# EAGLE schematic wachcio_meteo_unlock (EAGLE 7.7.0)

## Sheet 1 of 3: urzadzenie
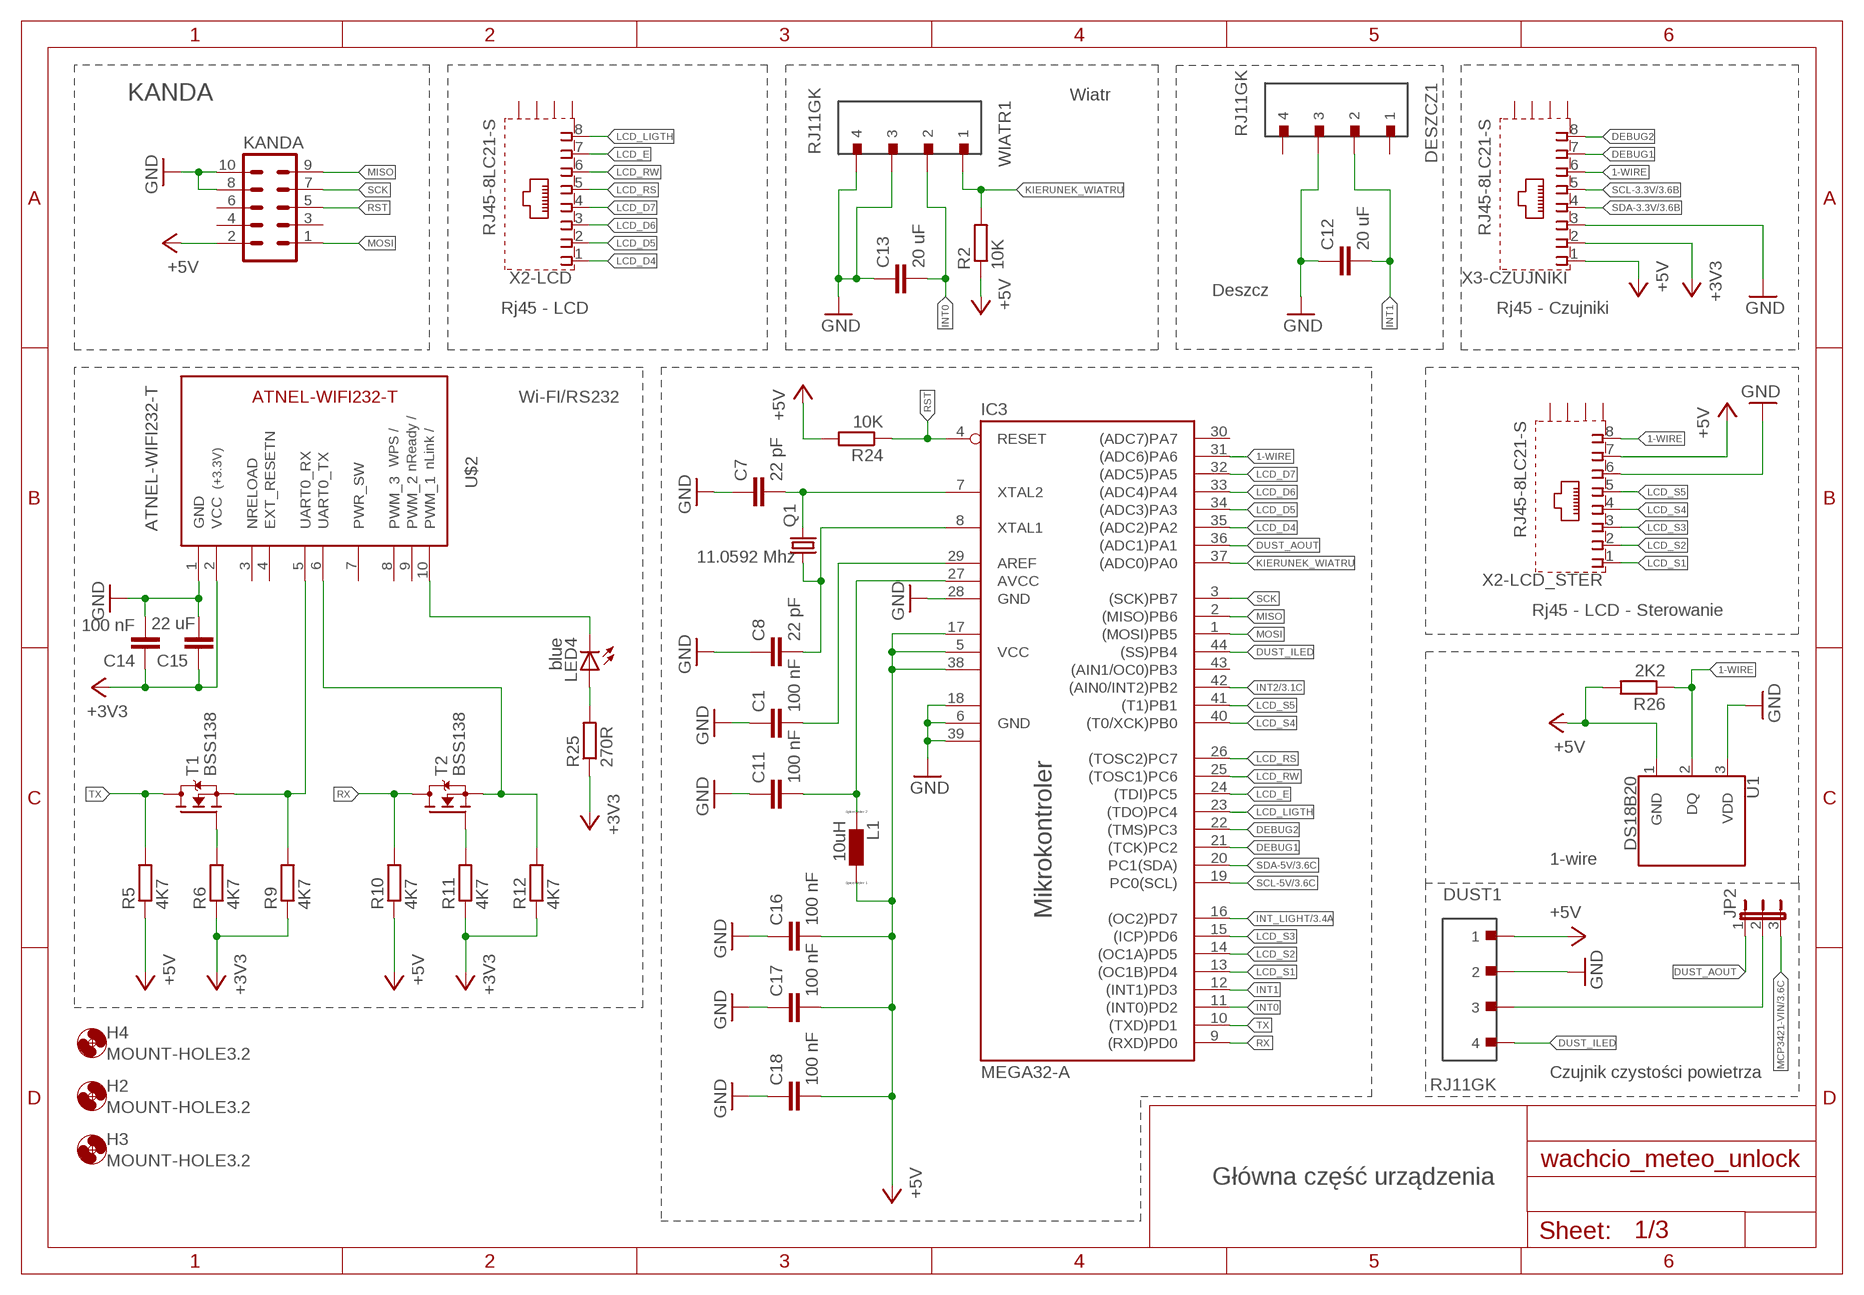
[diagram p0: schematic, sheet 1]

### Parts
C1  100 nF  C-EUC0805  [C0805]
C7  22 pF  C-EUC0805  [C0805]
C8  22 pF  C-EUC0805  [C0805]
C11  100 nF  C-EUC0805  [C0805]
C12  20 uF  C-EUC0805  [C0805]
C13  20 uF  C-EUC0805  [C0805]
C14  100 nF  C-EUC0805  [C0805]
C15  22 uF  C-EUC0805  [C0805]
C16  100 nF  C-EUC0805  [C0805]
C17  100 nF  C-EUC0805  [C0805]
C18  100 nF  C-EUC0805  [C0805]
DESZCZ1  RJ11GK  [RJ11GK]
DUST1  RJ11GK  [RJ11GK]
H2  MOUNT-HOLE3.2  [3,2]
H3  MOUNT-HOLE3.2  [3,2]
H4  MOUNT-HOLE3.2  [3,2]
IC3  MEGA32-A  [TQFP44]
JP2  JP2E  [JP2]
KANDA  ML10  [ML10]
L1  10uH  LL3230M  [L3230M]
LED4  blue  LEDCHIPLED_1206  [CHIPLED_1206]
Q1  11.0592 Mhz  CRYSTALSM49  [SM49]
R2  10K  R-EU_M0805  [M0805]
R5  4K7  R-EU_M0805  [M0805]
R6  4K7  R-EU_M0805  [M0805]
R9  4K7  R-EU_M0805  [M0805]
R10  4K7  R-EU_M0805  [M0805]
R11  4K7  R-EU_M0805  [M0805]
R12  4K7  R-EU_M0805  [M0805]
R24  10K  R-EU_M0805  [M0805]
R25  270R  R-EU_M0805  [M0805]
R26  2K2  R-EU_M0805  [M0805]
T1  BSS138  MOSFET-N-SOT23  [SOT23]
T2  BSS138  MOSFET-N-SOT23  [SOT23]
U1  DS18B20  [TO-92-AMMO]
U$2  ATNEL-WIFI232-T  [ATNEL-WIFI232-T]
WIATR1  RJ11GK  [RJ11GK]
X2-LCD  RJ45-8LC21-S  [RJ45-SHIELD1]
X2-LCD_STER  RJ45-8LC21-S  [RJ45-SHIELD1]
X3-CZUJNIKI  RJ45-8LC21-S  [RJ45-SHIELD1]

### Nets
1-WIRE: IC3.31((ADC6)PA6) R26.1 U1.2(DQ) X2-LCD_STER.8 X3-CZUJNIKI.6
+3V3: C14.1 C15.1 R6.1 R9.1 R11.1 R12.1 R25.1 U$2.2(VCC) X3-CZUJNIKI.2 ; also sheet 2,3
+5V: C16.2 C17.2 C18.2 DUST1.1 IC3.5(VCC) IC3.17(VCC1) IC3.38(VCC2) KANDA.2 L1.1 R2.1 R5.1 R10.1 R24.2 R26.2 U1.1(GND) X2-LCD_STER.7 X3-CZUJNIKI.1 ; also sheet 2,3
DEBUG1: IC3.21((TCK)PC2) X3-CZUJNIKI.7
DEBUG2: IC3.22((TMS)PC3) X3-CZUJNIKI.8
DUST_AOUT: IC3.36((ADC1)PA1) JP2.1
DUST_ILED: DUST1.4 IC3.44((SS)PB4)
GND: C1.1 C7.1 C8.1 C11.1 C12.1 C13.1 C14.2 C15.2 C16.1 C17.1 C18.1 DESZCZ1.3 DUST1.2 IC3.6(GND) IC3.18(GND1) IC3.28(GND) IC3.39(GND2) KANDA.8 KANDA.10 U1.3(VDD) U$2.1(GND) WIATR1.3 WIATR1.4 X2-LCD_STER.6 X3-CZUJNIKI.3 ; also sheet 2,3
INT0: C13.2 IC3.11((INT0)PD2) WIATR1.2
INT1: C12.2 DESZCZ1.2 IC3.12((INT1)PD3)
INT2: IC3.42((AIN0/INT2)PB2) ; also sheet 3
INT_LIGHT: IC3.16((OC2)PD7) ; also sheet 3
KIERUNEK_WIATRU: IC3.37((ADC0)PA0) R2.2 WIATR1.1
LCD_D4: IC3.35((ADC2)PA2) X2-LCD.1
LCD_D5: IC3.34((ADC3)PA3) X2-LCD.2
LCD_D6: IC3.33((ADC4)PA4) X2-LCD.3
LCD_D7: IC3.32((ADC5)PA5) X2-LCD.4
LCD_E: IC3.24((TDI)PC5) X2-LCD.7
LCD_LIGTH: IC3.23((TDO)PC4) X2-LCD.8
LCD_RS: IC3.26((TOSC2)PC7) X2-LCD.5
LCD_RW: IC3.25((TOSC1)PC6) X2-LCD.6
LCD_S1: IC3.13((OC1B)PD4) X2-LCD_STER.1
LCD_S2: IC3.14((OC1A)PD5) X2-LCD_STER.2
LCD_S3: IC3.15((ICP)PD6) X2-LCD_STER.3
LCD_S4: IC3.40((T0/XCK)PB0) X2-LCD_STER.4
LCD_S5: IC3.41((T1)PB1) X2-LCD_STER.5
MCP3421-VIN: JP2.3 ; also sheet 3
MISO: IC3.2((MISO)PB6) KANDA.9
MOSI: IC3.1((MOSI)PB5) KANDA.1
N$1: R9.2 T1.2(S) U$2.5(UART0_RX)
N$2: C11.2 IC3.27(AVCC) L1.2
N$3: C1.2 IC3.29(AREF)
N$5: LED4.A R25.2
N$6: R6.2 T1.1(G)
N$8: LED4.C U$2.10(PWM_1)
N$9: R12.2 T2.2(S) U$2.6(UART0_TX)
N$10: C7.2 IC3.7(XTAL2) Q1.2
N$11: C8.2 IC3.8(XTAL1) Q1.1
N$16: DUST1.3 JP2.2
N$22: R11.2 T2.1(G)
RST: IC3.4(RESET) KANDA.5 R24.1
RX: IC3.9((RXD)PD0) R10.2 T2.3(D)
SCK: IC3.3((SCK)PB7) KANDA.7
SCL-3.3V: X3-CZUJNIKI.5 ; also sheet 3
SCL-5V: IC3.19(PC0(SCL)) ; also sheet 3
SDA-3.3V: X3-CZUJNIKI.4 ; also sheet 3
SDA-5V: IC3.20(PC1(SDA)) ; also sheet 3
TX: IC3.10((TXD)PD1) R5.2 T1.3(D)
Unconnected: DESZCZ1.1 DESZCZ1.4 IC3.30((ADC7)PA7) IC3.43((AIN1/OC0)PB3) KANDA.3 KANDA.4 KANDA.6 U$2.3(NRELOAD) U$2.4(EXT_RESETN) U$2.7(PWR_SW) U$2.8(PWM_3) U$2.9(PWM_2) X2-LCD.S1(S) X2-LCD.S2(S) X2-LCD.S3(S) X2-LCD.S4(S) X2-LCD_STER.S1(S) X2-LCD_STER.S2(S) X2-LCD_STER.S3(S) X2-LCD_STER.S4(S) X3-CZUJNIKI.S1(S) X3-CZUJNIKI.S2(S) X3-CZUJNIKI.S3(S) X3-CZUJNIKI.S4(S)

### Notes on the sheet
- KANDA | Wiatr
- Deszcz
- Rj45 - LCD | Rj45 - Czujniki
- Wi-FI/RS232
- Rj45 - LCD - Sterowanie
- 1-wire
- Mikrokontroler
- Czujnik czystości powietrza
- Główna część urządzenia

## Sheet 2 of 3: zasilanie
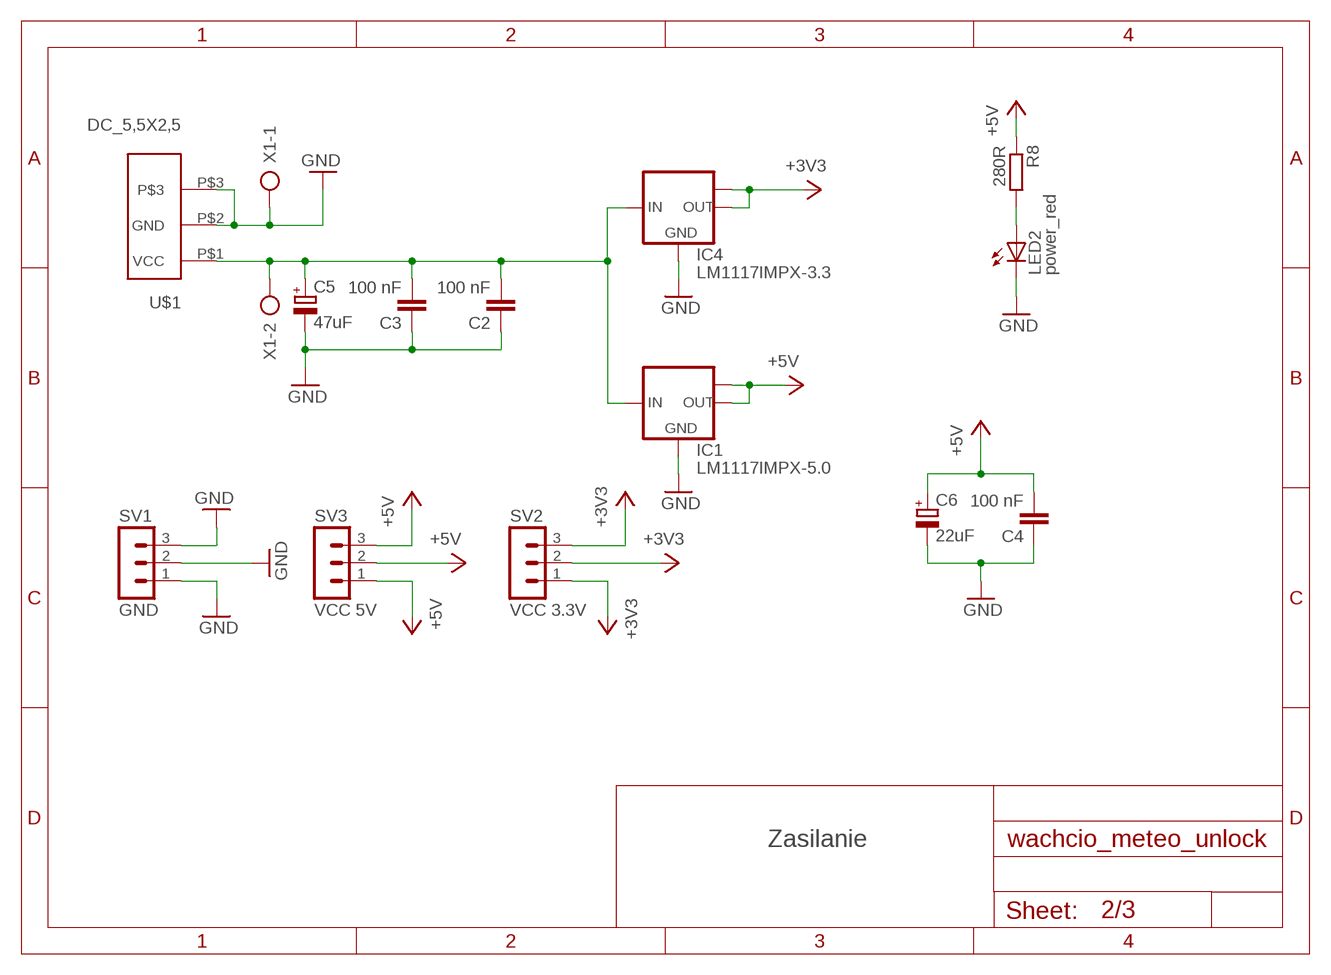
[diagram p1: schematic, sheet 2]

### Parts
C2  100 nF  C-EUC0805  [C0805]
C3  100 nF  C-EUC0805  [C0805]
C4  100 nF  C-EUC0805  [C0805]
C5  47uF  CPOL-EUB45181A  [B45181A]
C6  22uF  CPOL-EUB45181A  [B45181A]
IC1  LM1117IMPX-5.0  [SOT223]
IC4  LM1117IMPX-3.3  [SOT223]
LED2  power_red  LEDCHIPLED_1206  [CHIPLED_1206]
R8  280R  R-EU_M0805  [M0805]
SV1  GND  MA03-1  [MA03-1]
SV2  VCC 3.3V  MA03-1  [MA03-1]
SV3  VCC 5V  MA03-1  [MA03-1]
U$1  DC_5,5X2,5  [DC_5,5X2,5]
X1  AK500/2  [AK500/2]

### Nets
+3V3: IC4.2(OUT) IC4.TAB(OUT1) SV2.1 SV2.2 SV2.3 ; also sheet 1,3
+5V: C4.2 C6.+ IC1.2(OUT) IC1.TAB(OUT1) R8.1 SV3.1 SV3.2 SV3.3 ; also sheet 1,3
+9V: C2.2 C3.2 C5.+ IC1.3(IN) IC4.3(IN) U$1.P$1(VCC) X1.2
GND: C2.1 C3.1 C4.1 C5.- C6.- IC1.1(GND) IC4.1(GND) LED2.C SV1.1 SV1.2 SV1.3 U$1.P$2(GND) U$1.P$3 X1.1 ; also sheet 1,3
N$12: LED2.A R8.2

### Notes on the sheet
- Zasilanie

## Sheet 3 of 3: I2C
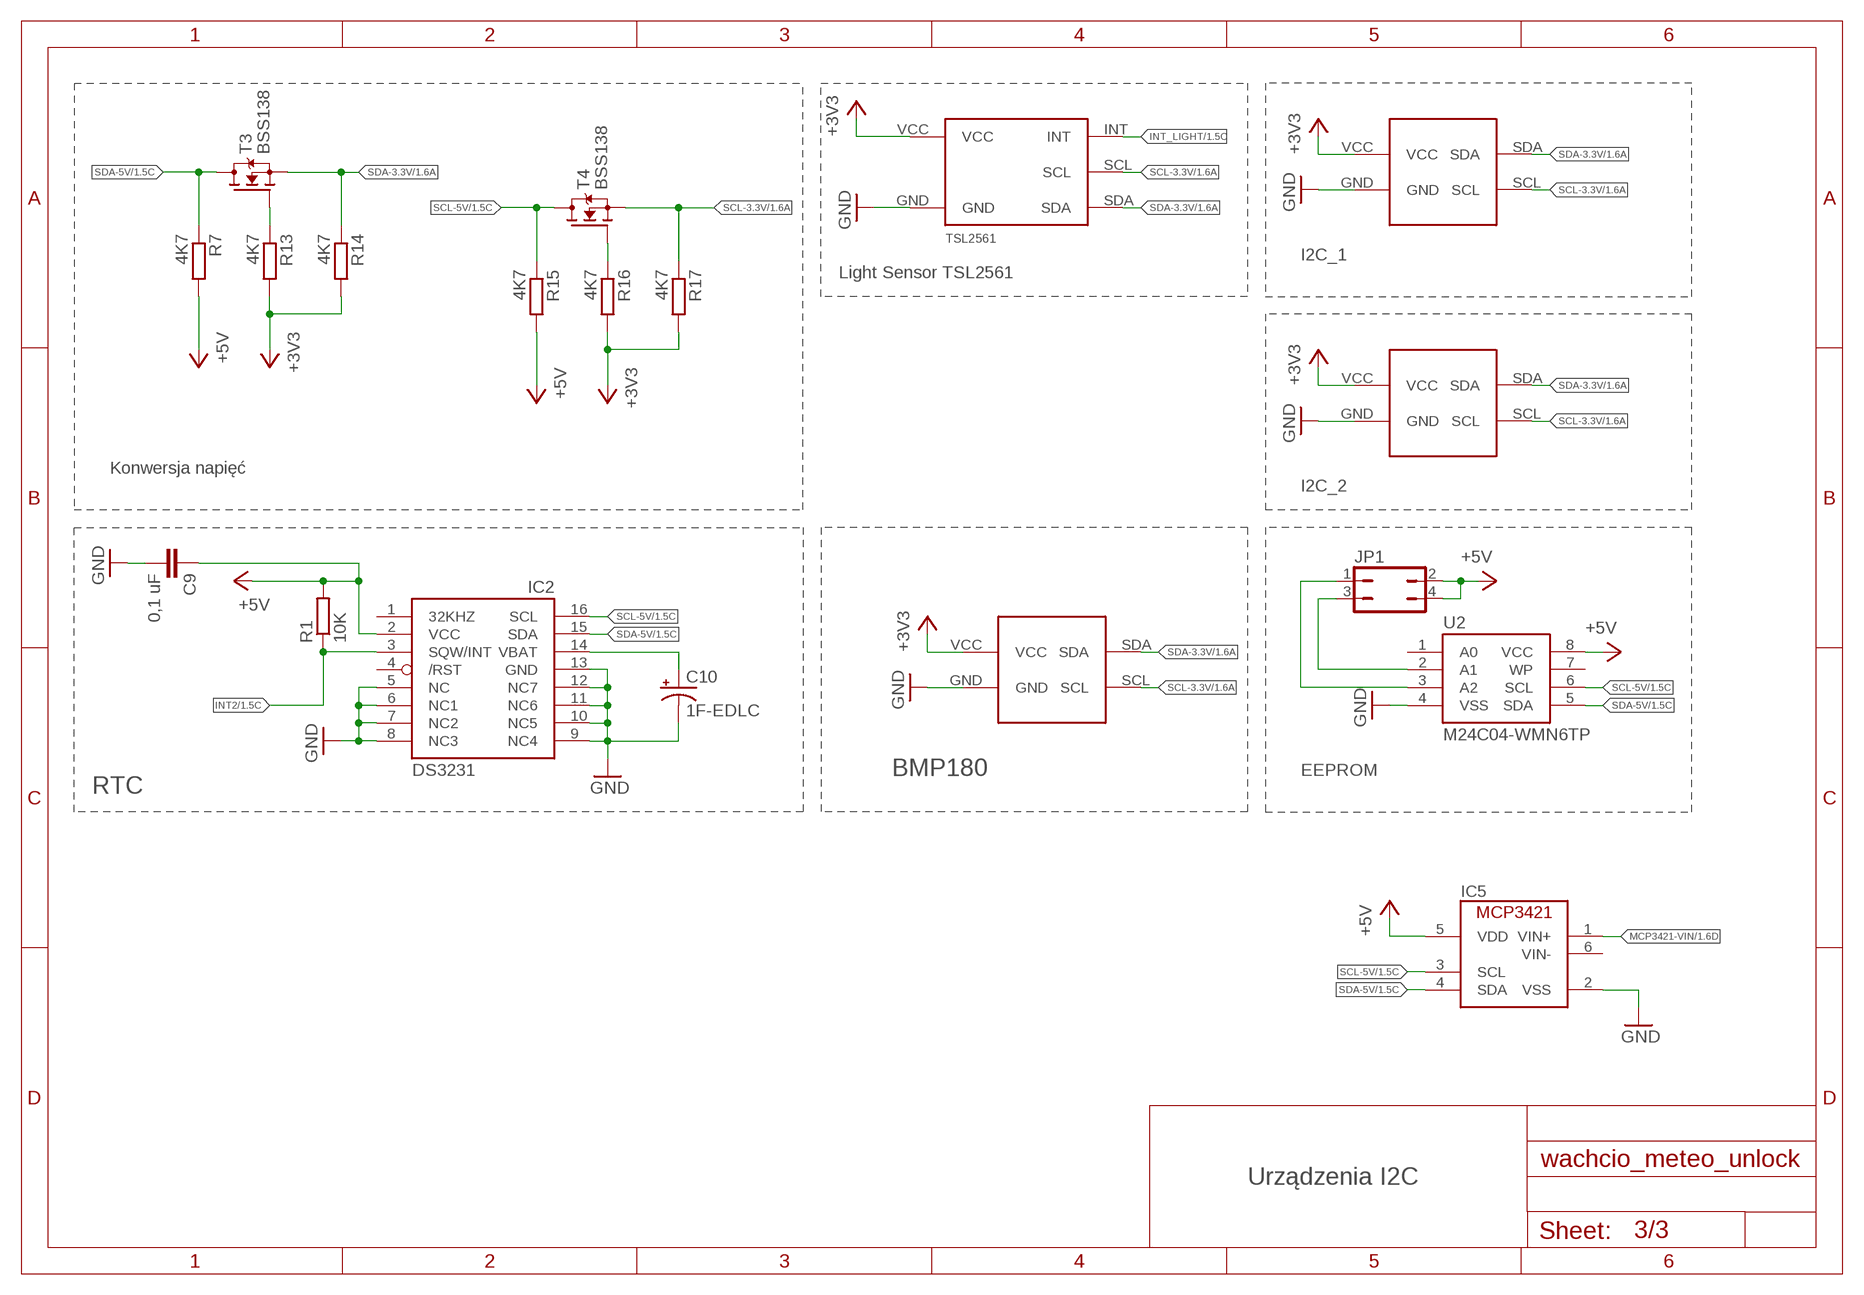
[diagram p2: schematic, sheet 3]

### Parts
C9  0,1 uF  C-EUC0805  [C0805]
C10  1F-EDLC  [CAP-RADIAL-5MM-21.5MM]
IC2  DS3231/SO  [SO16W]
IC5  MCP3421  [SOT-23]
JP1  JP2Q  [JP2Q]
R1  10K  R-EU_M0805  [M0805]
R7  4K7  R-EU_M0805  [M0805]
R13  4K7  R-EU_M0805  [M0805]
R14  4K7  R-EU_M0805  [M0805]
R15  4K7  R-EU_M0805  [M0805]
R16  4K7  R-EU_M0805  [M0805]
R17  4K7  R-EU_M0805  [M0805]
T3  BSS138  MOSFET-N-SOT23  [SOT23]
T4  BSS138  MOSFET-N-SOT23  [SOT23]
U2  M24C04-WMN6TP  EEPROM-I2CSMD  [SO08]
U$3  BMP180  [BMP180]
U$5  I2C_BOARD  [I2C_BOARD]
U$6  I2C_BOARD  [I2C_BOARD]
U$7  TSL2561GY-2561  [TSL2561]

### Nets
+3V3: R13.2 R14.2 R16.2 R17.2 U$3.VCC U$5.VCC U$6.VCC U$7.VCC ; also sheet 1,2
+5V: C9.1 IC2.2(VCC) IC5.5(VDD) JP1.2 JP1.4 R1.2 R7.2 R15.2 U2.8(VCC) ; also sheet 1,2
GND: C9.2 C10.- IC2.5(NC) IC2.6(NC1) IC2.7(NC2) IC2.8(NC3) IC2.9(NC4) IC2.10(NC5) IC2.11(NC6) IC2.12(NC7) IC2.13(GND) IC5.2(VSS) U2.4(VSS) U$3.GND U$5.GND U$6.GND U$7.GND ; also sheet 1,2
INT2: IC2.3(SQW/INT) R1.1 ; also sheet 1
INT_LIGHT: U$7.INT ; also sheet 1
MCP3421-VIN: IC5.1(VIN+) ; also sheet 1
N$7: C10.+ IC2.14(VBAT)
N$25: R13.1 T3.1(G)
N$27: R16.1 T4.1(G)
N$32: JP1.3 U2.2(A1)
N$33: JP1.1 U2.3(A2)
SCL-3.3V: R17.1 T4.2(S) U$3.SCL U$5.SCL U$6.SCL U$7.SCL ; also sheet 1
SCL-5V: IC2.16(SCL) IC5.3(SCL) R15.1 T4.3(D) U2.6(SCL) ; also sheet 1
SDA-3.3V: R14.1 T3.2(S) U$3.SDA U$5.SDA U$6.SDA U$7.SDA ; also sheet 1
SDA-5V: IC2.15(SDA) IC5.4(SDA) R7.1 T3.3(D) U2.5(SDA) ; also sheet 1
Unconnected: IC2.1(32KHZ) IC2.4(/RST) IC5.6(VIN-) U2.1(A0) U2.7(WP)

### Notes on the sheet
- I2C_1
- Light Sensor TSL2561
- Konwersja napięć
- I2C_2
- BMP180 | EEPROM
- RTC
- Urządzenia I2C

## Library data of the parts
C1-C4 C7-C9 C11-C18 = rcl:C-EU: CAPACITOR, European symbol
C5 C6 = rcl:CPOL-EU: POLARIZED CAPACITOR, European symbol
C10 = SparkFun-Capacitors:1F-EDLC: [Eaton] [KR-5R5C105-R] - [1F Electric Double Layer Capacitor (SuperCapacitor)] This is a 21.5mm OD 1F SuperCapacitor.; PROD_ID: CAP-13904
DESZCZ1 DUST1 WIATR1 = wachcio:RJ11GK
H2-H4 = holes:MOUNT-HOLE: MOUNTING HOLE with drill center marker
IC1 IC4 = lm1117:LM1117IMPX-*
IC2 = adafruit:DS3231
IC3 = atmel:MEGA32: MICROCONTROLLER 32 Kbytes FLASH 2 Kbytes SRAM 1 Kbytes EEPROM USART 8-channel 10 bit ADC Source: www.atmel.com .. doc2503.pdf; MPN: ATMEGA32-16AU; OC_FARNELL: 9171274; OC_NEWARK: 69K6677
IC5 = FaBo-Sensor:MCP3421
JP1 = jumper:JP2Q: JUMPER
JP2 = jumper:JP2E: JUMPER
KANDA = con-harting-ml:ML10: HARTING; OC_FARNELL: unknown; OC_NEWARK: unknown
L1 = eagle-ltspice:L: INDUCTOR, European symbol; SPICEMODEL: NONE; SPICEPREFIX: L
LED2 LED4 = adafruit:LED: LED OSRAM: - CHIPLED LG R971, LG N971, LY N971, LG Q971, LY Q971, LO R971, LY R971 LH N974, LH R974 LS Q976, LO Q976, LY Q976 LO Q996 - Hyper CHIPLED LW Q18S LB Q993, LB Q99A, LB R99A - SideLED LS A670, LO A670, LY A670, LG A670, LP A670 LB A673, LV A673, LT A673, LW A673 LH A674 LY A675 LS A676, LA A676, LO A676, LY A676, LW A676 LS A679, LY A679, LG A679 - Hyper Micro SIDELED® LS Y876, LA Y876, LO Y876, LY Y876 LT Y87S - SmartLED LW L88C, LW L88S LB L89C, LB L89S, LG L890 LS L89K, LO L89K, LY L89K LS L896, LA L896, LO L896, LY L896 - TOPLED LS T670, LO T670, LY T670, LG T670, LP T670 LSG T670, LSP T670, LSY T670, LOP T670, LYG T670 LG T671, LOG T671, LSG T671 LB T673, LV T673, LT T673, LW T673 LH T674 LS T676, LA T676, LO T676, LY T676, LB T676, LH T676, LSB T676, LW T676 LB T67C, LV T67C, LT T67C, LS T67K, LO T67K, LY T67K, LW E67C LS E67B, LA E67B, LO E67B, LY E67B, LB E67C, LV E67C, LT E67C LW T67C LS T679, LY T679, LG T679 LS T770, LO T770, LY T770, LG T770, LP T770 LB T773, LV T773, LT T773, LW T773 LH T774 LS E675, LA E675, LY E675, LS T675 LS T776, LA T776, LO T776, LY T776, LB T776 LHGB T686 LT T68C, LB T68C - Hyper Mini TOPLED® LB M676 - Mini TOPLED Santana® LG M470 LS M47K, LO M47K, LY M47K Source: http://www.osram.convergy.de/
Q1 = adafruit:CRYSTAL: CRYSTAL; OC_FARNELL: unknown; OC_NEWARK: unknown
R1 R2 R5-R17 R24-R26 = rcl:R-EU_: RESISTOR, European symbol
SV1-SV3 = con-lstb:MA03-1: PIN HEADER; OC_FARNELL: unknown; OC_NEWARK: unknown
T1-T4 = we-transistor:MOSFET-N: N-Channel MOSFET SOT23 N-Chn MOSFET TSM3404, IRLML2502 (Vgs>=+/-20V, Vds<=20V, Id>=3A + Rds<=0.05Ohm @ Vgs=4.5V) BSS138 (Vgs>=+/-20V, Vds<=40V, Id>=0.2A + Rds<=3Ohm @ Vgs=4.5V) SOT223 Low Side Switch with Protection (Infineon) BSP76 (Vin=0...10V, Vds<=42V, Id=1.4A + Rds=0.2Ohm @ Vin=5V) BSP77 (Vin=0...10V, Vds<=42V, Id=2.2A + Rds=0.1Ohm @ Vin=5V) D²Pak Low Side Switch with Protection (Infineon) BTS117TC (Vin=0...10V, Vds<=60V, Id=3.5A + Rds=0.12Ohm @ Vin=5V) BTS133TC (Vin=0...10V, Vds<=60V, Id=7A + Rds=0.06Ohm @ Vin=5V) BTS141TC (Vin=0...10V, Vds<=60V, Id=12A + Rds=0.03Ohm @ Vin=5V) BTS3018TC (Vin=0...10V, Vds<=60V, Id=6A + Rds=0.02Ohm @ Vin=5V)
U1 = SparkFun-Sensors:DS18B20: Dallas/Maxim DS18B20 1-Wire Temperature Sensor The DS18B20 reports degrees C with 9 to 12-bit precision, -55C to 125C (+/-0.5C). Each sensor has a unique 64-Bit Serial number etched into it - allows for a huge number of sensors to be used on one data bus. Datasheet <http://datasheets.maximintegrated.com/en/ds/DS18B20.pdf> SparkFun Products One Wire Digital Temperature Sensor - DS18B20 <https://www.sparkfun.com/products/245> (SEN-00245); STORE_ID: SEN-00245
U2 = SparkFun-IC-Memory:EEPROM-I2C: I2C EEPROMs, 24LC256 and others 24LC256 Series 256 kb I2C 2 Wire (32 k x 8 Bit) 2.5 V Serial EEPROM SMD - SOIC-8 Datasheet SparkFun Products SparkFun UDB5 - PIC UAV Development Board <https://www.sparkfun.com/products/11703> (GPS-11703); PROD_ID: IC-09714; VALUE: 24LC256
U$1 = wachcio:DC_5,5X2,5
U$2 = ATNEL-WIFI232-T:ATNEL-WIFI232-T
U$3 = boards:BMP180
U$5 U$6 = boards2:I2C_BOARD
U$7 = wachcio:TSL2561
X1 = con-ptr500:AK500/2: CONNECTOR; OC_FARNELL: unknown; OC_NEWARK: unknown
X2-LCD X2-LCD_STER X3-CZUJNIKI = con-tycoelectronics:RJ45*2: RJ45 Low Profile Shield Type 2 For all RJ45 L, LC, LCT and X Series Models Source: www.tycoelectronics.com .. ENG_DS_1654001_1099_RJ_L_0507.pdf; OC_FARNELL: unknown; OC_NEWARK: unknown